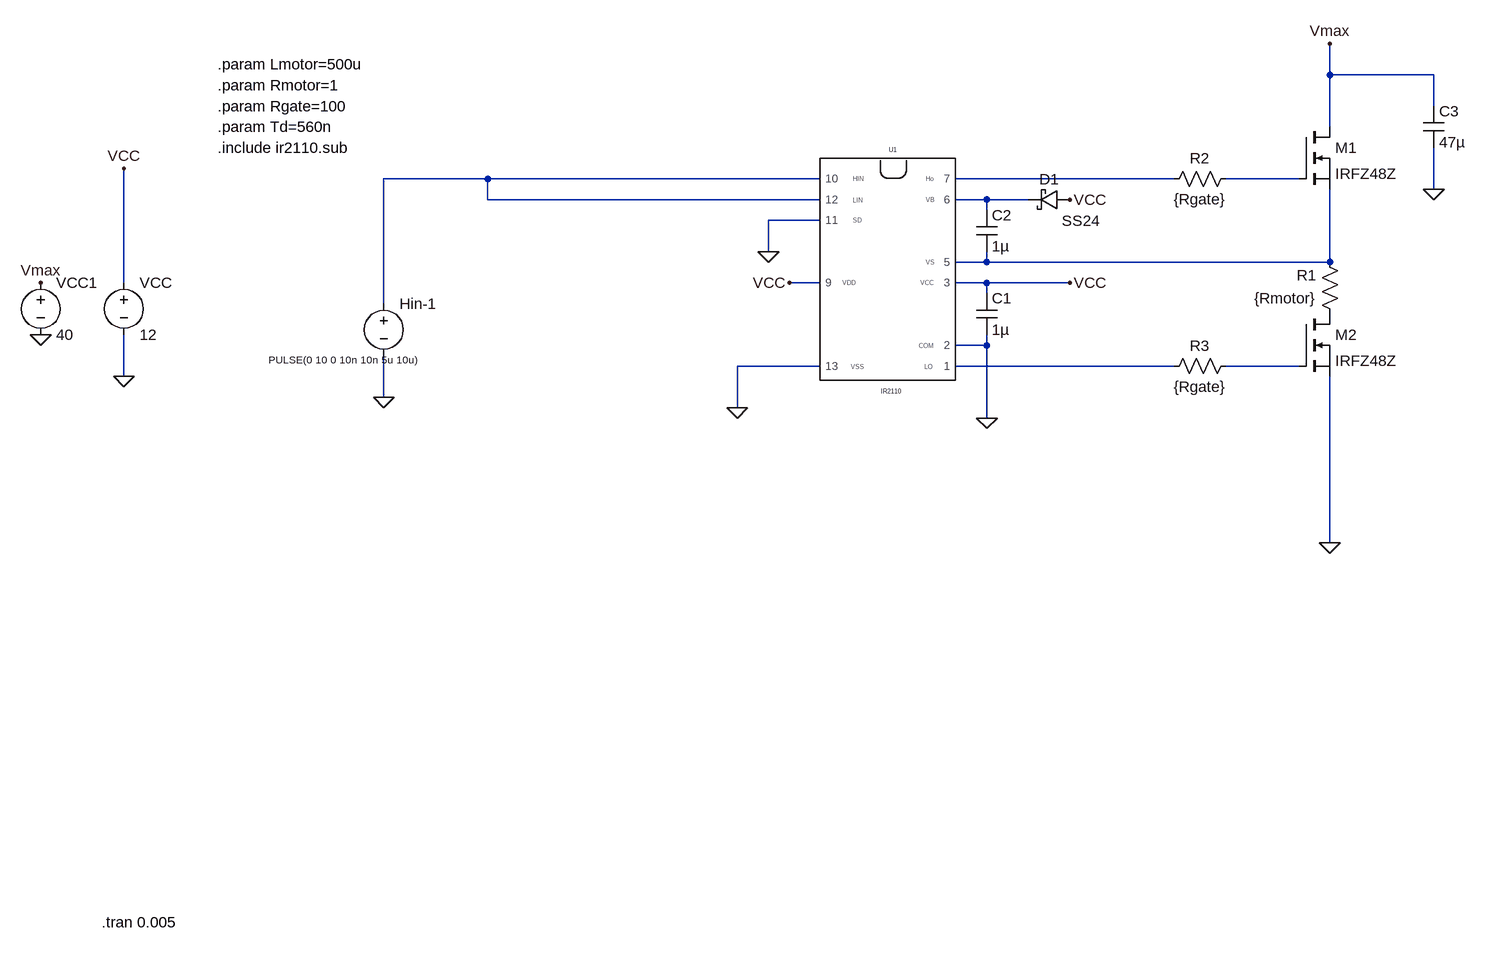
[diagram p0: schematic ır2110.asc]
ır2110.asc, the LTspice schematic file:
Version 4
SHEET 1 1876 2040
WIRE 672 -416 672 -464
WIRE 832 -416 672 -416
WIRE 832 -368 832 -416
WIRE 672 -336 672 -416
WIRE -624 -256 -784 -256
WIRE -112 -256 -624 -256
WIRE 432 -256 96 -256
WIRE 624 -256 512 -256
WIRE 832 -240 832 -304
WIRE -624 -224 -624 -256
WIRE -112 -224 -624 -224
WIRE 144 -224 96 -224
WIRE 208 -224 144 -224
WIRE 144 -208 144 -224
WIRE -112 -192 -192 -192
WIRE -192 -144 -192 -192
WIRE 144 -128 144 -144
WIRE 144 -128 96 -128
WIRE 672 -128 672 -240
WIRE 672 -128 144 -128
WIRE -1184 -96 -1184 -272
WIRE -112 -96 -160 -96
WIRE 144 -96 96 -96
WIRE 272 -96 144 -96
WIRE 144 -80 144 -96
WIRE -784 -64 -784 -256
WIRE 144 0 144 -16
WIRE 144 0 96 0
WIRE -112 32 -240 32
WIRE 432 32 96 32
WIRE 624 32 512 32
WIRE -1184 48 -1184 -16
WIRE -784 80 -784 16
WIRE -240 96 -240 32
WIRE 144 112 144 0
WIRE 672 304 672 48
FLAG 672 304 0
FLAG 144 112 0
FLAG 832 -240 0
FLAG -784 80 0
FLAG -1184 48 0
FLAG -1184 -272 VCC
FLAG -240 96 0
FLAG 272 -224 VCC
FLAG 272 -96 VCC
FLAG -160 -96 VCC
FLAG -192 -144 0
FLAG -1312 -16 0
FLAG -1312 -96 Vmax
FLAG 672 -464 Vmax
SYMBOL ir2110 -16 -112 R0
SYMATTR InstName U1
SYMBOL nmos 624 -336 R0
SYMATTR InstName M1
SYMATTR Value IRFZ48Z
SYMBOL nmos 624 -48 R0
SYMATTR InstName M2
SYMATTR Value IRFZ48Z
SYMBOL voltage -1184 -112 R0
WINDOW 123 0 0 Left 0
WINDOW 39 0 0 Left 0
SYMATTR InstName VCC
SYMATTR Value 12
SYMBOL cap 128 -80 R0
SYMATTR InstName C1
SYMATTR Value 1µ
SYMBOL cap 128 -208 R0
SYMATTR InstName C2
SYMATTR Value 1µ
SYMBOL schottky 272 -240 R90
WINDOW 0 0 32 VBottom 2
WINDOW 3 33 -17 VTop 2
SYMATTR InstName D1
SYMATTR Value SS24
SYMATTR Description Diode
SYMATTR Type diode
SYMBOL cap 816 -368 R0
SYMATTR InstName C3
SYMATTR Value 47µ
SYMBOL res 688 -32 R180
WINDOW 0 36 76 Left 2
WINDOW 3 36 40 Left 2
SYMATTR InstName R1
SYMATTR Value {Rmotor}
SYMBOL voltage -784 -80 R0
WINDOW 123 0 0 Left 0
WINDOW 39 0 0 Left 0
WINDOW 3 -177 102 Left 1
SYMATTR Value PULSE(0 10 0 10n 10n 5u 10u)
SYMATTR InstName Hin-1
SYMBOL res 528 -272 R90
WINDOW 0 0 56 VBottom 2
WINDOW 3 32 56 VTop 2
SYMATTR InstName R2
SYMATTR Value {Rgate}
SYMBOL res 528 16 R90
WINDOW 0 0 56 VBottom 2
WINDOW 3 32 56 VTop 2
SYMATTR InstName R3
SYMATTR Value {Rgate}
SYMBOL voltage -1312 -112 R0
WINDOW 123 0 0 Left 0
WINDOW 39 0 0 Left 0
SYMATTR InstName VCC1
SYMATTR Value 40
TEXT -1040 -304 Left 2 !.include ir2110.sub
TEXT -1040 -336 Left 2 !.param Td=560n
TEXT -1040 -368 Left 2 !.param Rgate=100
TEXT -1040 -400 Left 2 !.param Rmotor=1
TEXT -1040 -432 Left 2 !.param Lmotor=500u
TEXT -1218 888 Left 2 !.tran 0.005

The netlist it stands for:
* ır2110.asc
XU1 VCC N001 0 N001 0 N002 N004 N005 VCC 0 N006 IR2110  ; pins 9 10 11 12 13 7 6 5 3 2 1
M1 Vmax N003 N005 N005 IRFZ48Z
M2 P001 N007 0 0 IRFZ48Z
VCC VCC 0 12
C1 VCC 0 1µ
C2 N004 N005 1µ
D1 VCC N004 SS24
C3 Vmax 0 47µ
R1 P001 N005 {Rmotor}
V§Hin-1 N001 0 PULSE(0 10 0 10n 10n 5u 10u)
R2 N003 N002 {Rgate}
R3 N007 N006 {Rgate}
VCC1 Vmax 0 40
.model D D
.lib standard.dio
.model NMOS NMOS
.model PMOS PMOS
.lib standard.mos
.include ir2110.sub
.param Td=560n
.param Rgate=100
.param Rmotor=1
.param Lmotor=500u
.tran 0.005
.backanno
.end